# Altium project STM32F103RE.PrjPCB
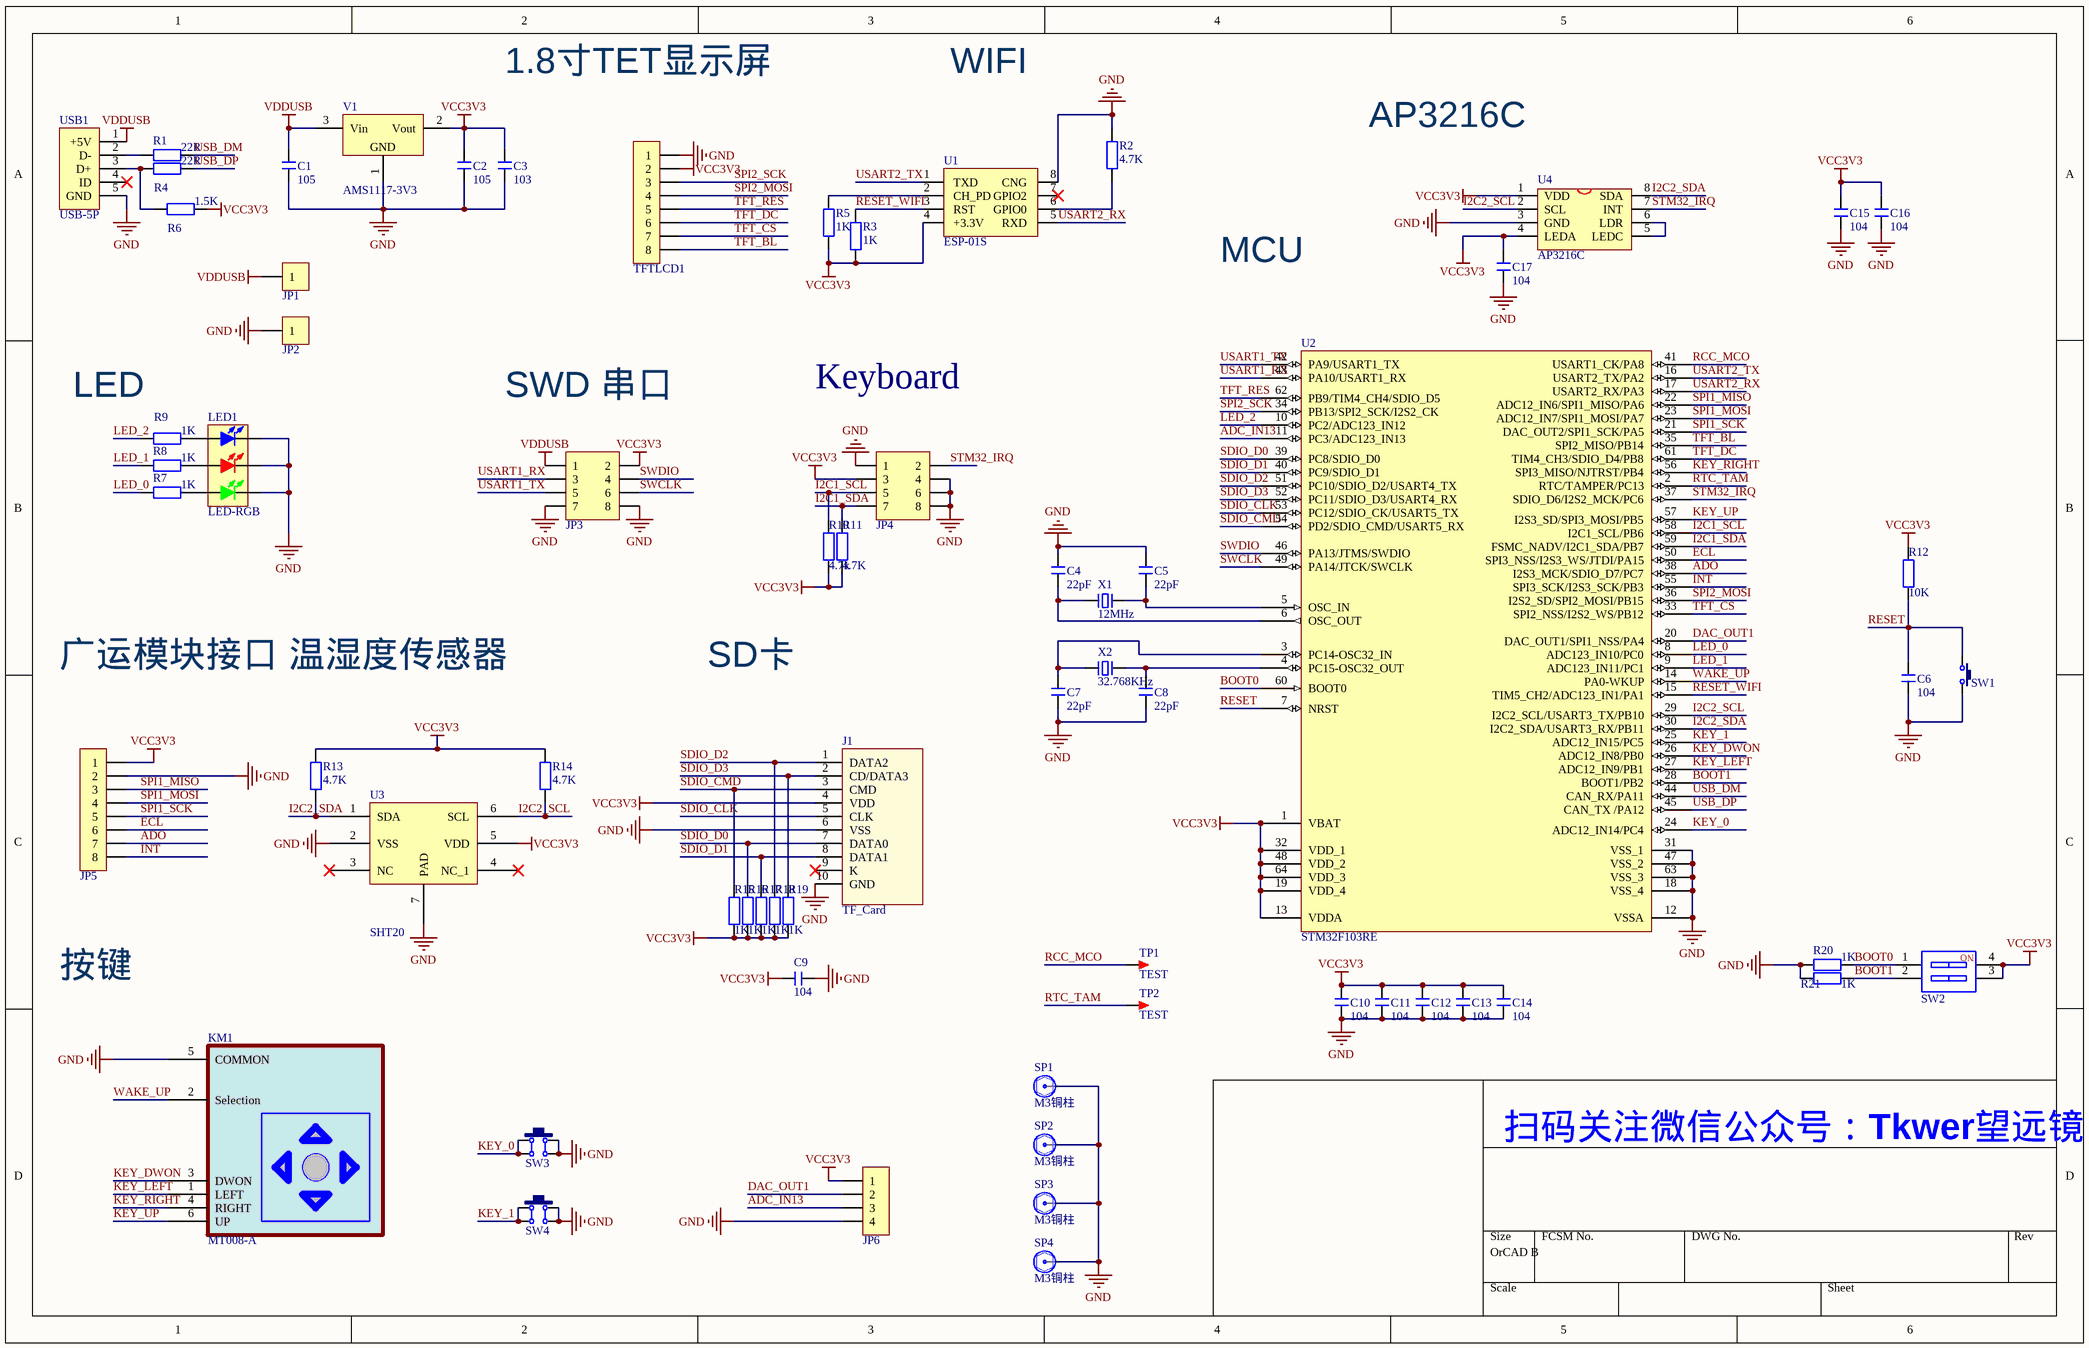
[diagram p0: STM32F103RE.SchDoc]
1 sheet, 66 parts. Net scope: global (net labels, ports and power ports of the same name join across sheets).
Board file: STM32F103RE.PcbDoc

## Sheet STM32F103RE.SchDoc
size OrCAD B

### Parts
C1  105  [C 0805_L]
C2  105  [C 0805_L]
C3  103  [C 0603_L]
C4  22pF  [C 0603_L]
C5  22pF  [C 0603_L]
C6  104  [C 0603_L]
C7  22pF  [C 0603_L]
C8  22pF  [C 0603_L]
C9  104  [C 0603_L]
C10  104  [C 0603_L]
C11  104  [C 0603_L]
C12  104  [C 0603_L]
C13  104  [C 0603_L]
C14  104  [C 0603_L]
C15  104  [C 0603_L]
C16  104  [C 0603_L]
C17  104  [C 0603_L]
J1  TF_Card  [Micro SD]
JP1  HDR-1X1  [HDR2.54-LI-1P]  (value not drawn)
JP2  HDR-1X1  [HDR2.54-LI-1P]  (value not drawn)
JP3  Header 4X2  [HDR2.54-WI-2x4P]  (value not drawn)
JP4  Header 4X2  [HDR2.54-WI-2x4P]  (value not drawn)
JP5  HDR-1X8  [HDR2.54-M-LI-8P]  (value not drawn)
JP6  HDR-1X4  [HDR2.54-LI-4P]  (value not drawn)
KM1  MT008-A  [JOY_MT008-A]
LED1  LED-RGB  [LED 5050]
R1  22R  [R 0603_L]
R2  4.7K  [R 0603_L]
R3  1K  [R 0603_L]
R4  22R  [R 0603_L]
R5  1K  [R 0603_L]
R6  1.5K  [R 0603_L]
R7  1K  [R 0603_L]
R8  1K  [R 0603_L]
R9  1K  [R 0603_L]
R10  4.7k  [R 0603_L]
R11  4.7K  [R 0603_L]
R12  10K  [R 0603_L]
R13  4.7K  [R 0603_L]
R14  4.7K  [R 0603_L]
R15  1K  [R 0603_L]
R16  1K  [R 0603_L]
R17  1K  [R 0603_L]
R18  1K  [R 0603_L]
R19  1K  [R 0603_L]
R20  1K  [R 0603_L]
R21  1K  [R 0603_L]
SP1  M3铜柱  [M3x4_L]
SP2  M3铜柱  [M3x4_L]
SP3  M3铜柱  [M3x4_L]
SP4  M3铜柱  [M3x4_L]
SW1  3x6x5  [TSW SMD-3*6*2.5]  (value not drawn)
SW2  CSW-2P  [CSW1.27 SMD-2P]  (value not drawn)
SW3  6x6x5  [SODFL700X110-2N]  (value not drawn)
SW4  6x6x5  [SODFL700X110-2N]  (value not drawn)
TFTLCD1  HDR-1X8  [HDR2.54-M-LI-8P]  (value not drawn)
TP1  TEST  [TEST 1.6]
TP2  TEST  [TEST 1.6]
U1  ESP-01S  [ESP-01S]
U2  STM32F103RE  [LQFP64 10X10_N]
U3  SHT20  [sht20]
U4  AP3216C  [DFN8]
USB1  USB-5P  [USB-MICRO_A]
V1  AMS1117-3V3  [SOT223_L]
X1  12MHz  [OSC 5032-2P]
X2  32.768KHz  [XTAL-3215]

### Nets
GND: C1.1 C2.1 C3.1 C4.2 C5.2 C6.1 C7.1 C8.1 C9.2 C10.1 C11.1 C12.1 C13.1 C14.1 C15.2 C16.2 C17.2 J1.6(VSS) J1.10(GND) JP2.1 JP3.7 JP3.8 JP4.1 JP4.4 JP4.6 JP4.8 JP5.2 JP6.4 KM1.5(COMMON) LED1.2(BULE_K) LED1.4(RED_K) LED1.6(GREEN_K) R2.2 R20.1 R21.1 SP1.1 SP2.1 SP3.1 SP4.1 SW1.2 SW3.2 SW3.3 SW4.2 SW4.3 TFTLCD1.1 U1.8(CNG) U2.12(VSSA) U2.18(VSS_4) U2.31(VSS_1) U2.47(VSS_2) U2.63(VSS_3) U3.2(VSS) U3.7(PAD) U4.3(GND) USB1.5(GND) V1.1(GND)
VCC3V3: C2.2 C3.2 C9.1 C10.2 C11.2 C12.2 C13.2 C14.2 C15.1 C16.1 C17.1 J1.4(VDD) JP3.2 JP4.3 JP5.1 JP6.1 R3.2 R5.2 R6.1 R10.1 R11.1 R12.2 R13.1 R14.1 R15.1 R16.1 R17.1 R18.1 R19.1 SW2.3 SW2.4 TFTLCD1.2 U1.4(+3.3V) U2.1(VBAT) U2.13(VDDA) U2.19(VDD_4) U2.32(VDD_1) U2.48(VDD_2) U2.64(VDD_3) U3.5(VDD) U4.1(VDD) U4.4(LEDA) V1.2(Vout)
VDDUSB: C1.2 JP1.1 JP3.1 USB1.1(+5V) V1.3(Vin)
ADC_IN13: JP6.3 U2.11(PC3/ADC123_IN13)
ADO: JP5.7 U2.38(I2S3_MCK/SDIO_D7/PC7)
BOOT0: R20.2 SW2.1 U2.60(BOOT0)
BOOT1: R21.2 SW2.2 U2.28(BOOT1/PB2)
DAC_OUT1: JP6.2 U2.20(DAC_OUT1/SPI1_NSS/PA4)
ECL: JP5.6 U2.50(SPI3_NSS/I2S3_WS/JTDI/PA15)
I2C1_SCL: JP4.5 R10.2 U2.58(I2C1_SCL/PB6)
I2C1_SDA: JP4.7 R11.2 U2.59(FSMC_NADV/I2C1_SDA/PB7)
I2C2_SCL: R14.2 U2.29(I2C2_SCL/USART3_TX/PB10) U3.6(SCL) U4.2(SCL)
I2C2_SDA: R13.2 U2.30(I2C2_SDA/USART3_RX/PB11) U3.1(SDA) U4.8(SDA)
INT: JP5.8 U2.55(SPI3_SCK/I2S3_SCK/PB3)
KEY_0: SW3.1 SW3.4 U2.24(ADC12_IN14/PC4)
KEY_1: SW4.1 SW4.4 U2.25(ADC12_IN15/PC5)
KEY_DWON: KM1.3(DWON) U2.26(ADC12_IN8/PB0)
KEY_LEFT: KM1.1(LEFT) U2.27(ADC12_IN9/PB1)
KEY_RIGHT: KM1.4(RIGHT) U2.56(SPI3_MISO/NJTRST/PB4)
KEY_UP: KM1.6(UP) U2.57(I2S3_SD/SPI3_MOSI/PB5)
LED_0: R7.2 U2.8(ADC123_IN10/PC0)
LED_1: R8.2 U2.9(ADC123_IN11/PC1)
LED_2: R9.2 U2.10(PC2/ADC123_IN12)
RCC_MCO: TP1.1 U2.41(USART1_CK/PA8)
RESET: C6.2 R12.1 SW1.1 U2.7(NRST)
RESET_WIFI: R3.1 U1.3(RST) U2.15(TIM5_CH2/ADC123_IN1/PA1)
RTC_TAM: TP2.1 U2.2(RTC/TAMPER/PC13)
SDIO_CLK: J1.5(CLK) U2.53(PC12/SDIO_CK/USART5_TX)
SDIO_CMD: J1.3(CMD) R15.2 U2.54(PD2/SDIO_CMD/USART5_RX)
SDIO_D0: J1.7(DATA0) R16.2 U2.39(PC8/SDIO_D0)
SDIO_D1: J1.8(DATA1) R17.2 U2.40(PC9/SDIO_D1)
SDIO_D2: J1.1(DATA2) R18.2 U2.51(PC10/SDIO_D2/USART4_TX)
SDIO_D3: J1.2(CD/DATA3) R19.2 U2.52(PC11/SDIO_D3/USART4_RX)
SPI1_MISO: JP5.3 U2.22(ADC12_IN6/SPI1_MISO/PA6)
SPI1_MOSI: JP5.4 U2.23(ADC12_IN7/SPI1_MOSI/PA7)
SPI1_SCK: JP5.5 U2.21(DAC_OUT2/SPI1_SCK/PA5)
SPI2_MOSI: TFTLCD1.4 U2.36(I2S2_SD/SPI2_MOSI/PB15)
SPI2_SCK: TFTLCD1.3 U2.34(PB13/SPI2_SCK/I2S2_CK)
STM32_IRQ: JP4.2 U2.37(SDIO_D6/I2S2_MCK/PC6) U4.7(INT)
SWCLK: JP3.6 U2.49(PA14/JTCK/SWCLK)
SWDIO: JP3.4 U2.46(PA13/JTMS/SWDIO)
TFT_BL: TFTLCD1.8 U2.35(SPI2_MISO/PB14)
TFT_CS: TFTLCD1.7 U2.33(SPI2_NSS/I2S2_WS/PB12)
TFT_DC: TFTLCD1.6 U2.61(TIM4_CH3/SDIO_D4/PB8)
TFT_RES: TFTLCD1.5 U2.62(PB9/TIM4_CH4/SDIO_D5)
USART1_RX: JP3.3 U2.43(PA10/USART1_RX)
USART1_TX: JP3.5 U2.42(PA9/USART1_TX)
USART2_RX: U1.5(RXD) U2.17(USART2_RX/PA3)
USART2_TX: U1.1(TXD) U2.16(USART2_TX/PA2)
USB_DM: R1.1 U2.44(CAN_RX/PA11)
USB_DP: R4.1 U2.45(CAN_TX_/PA12)
WAKE_UP: KM1.2(Selection) U2.14(PA0-WKUP)
NetC4_1: C4.1 U2.6(OSC_OUT) X1.2
NetC5_1: C5.1 U2.5(OSC_IN) X1.1
NetC7_2: C7.2 U2.3(PC14-OSC32_IN) X2.2
NetC8_2: C8.2 U2.4(PC15-OSC32_OUT) X2.1
NetLED1_1: LED1.1(BULE_A) R9.1
NetLED1_3: LED1.3(RED_A) R8.1
NetLED1_5: LED1.5(GREEN_A) R7.1
NetR1_2: R1.2 USB1.2(D-)
NetR2_1: R2.1 U1.6(GPIO0)
NetR4_2: R4.2 R6.2 USB1.3(D+)
NetR5_1: R5.1 U1.2(CH_PD)
NetU4_5: U4.5(LEDC) U4.6(LDR)

Not connected (* = marked no-connect by the designer): J1 9(K)*; U1 7(GPIO2)*; U3 3(NC)* 4(NC_1)*; USB1 4(ID)*

### Notes on the sheet
- 1.8寸TET显示屏
- WIFI
- AP3216C
- MCU
- LED
- SWD 串口
- Keyboard
- 广运模块接口
- 温湿度传感器
- SD卡
- 按键
- 扫码关注微信公众号：Tkwer望远镜
- (in symbol CSW-2P) NO

### Library data of the parts
C1-C17 = C: 无极性贴片电容; 版权归属: 源创客; BOM名称: 无极性贴片电容; 学习资源: www.ooocke.com
J1 = TF_Card: TF卡座; 版权归属: 源创客; BOM名称: TF卡座; 学习资源: www.ooocke.com
JP1 JP2 = Header 1: 1P接插件; 版权归属: 源创客; BOM名称: 1P接插件; 学习资源: www.ooocke.com
JP3 JP4 = Header 4X2: 4*2P接插件; 版权归属: 源创客; BOM名称: 4*2P接插件; 学习资源: www.ooocke.com
JP5 TFTLCD1 = Header 8: 8P接插件; 版权归属: 源创客; BOM名称: 8P接插件; 学习资源: www.ooocke.com
JP6 = Header 4: 4P接插件; 版权归属: 源创客; BOM名称: 4P接插件; 学习资源: www.ooocke.com
KM1 = MT-008A
LED1 = LED-RGB: 三基色LED; 版权归属: 源创客; BOM名称: 三基色LED; 学习资源: www.ooocke.com
R1-R21 = R: 贴片电阻; 版权归属: 源创客; BOM名称: 贴片电阻; 学习资源: www.ooocke.com
SP1-SP4 = 铜柱小焊盘: 铜柱; 版权归属: 源创客; BOM名称: 铜柱; 学习资源: www.ooocke.com
SW1 = TSW 3x6: 3x6轻触开关; 版权归属: 源创客; BOM名称: 3x6轻触开关; 学习资源: www.ooocke.com
SW2 = CSW-2P: 2路编码开关; 版权归属: 源创客; BOM名称: 2路编码开关; 学习资源: www.ooocke.com
SW3 SW4 = TSW SMD-6x6: 贴片6x6轻触开关; 版权归属: 源创客; BOM名称: 贴片6x6轻触开关; 学习资源: www.ooocke.com
TP1 TP2 = TEST: 测试点; 版权归属: 源创客; BOM名称: 测试点; 学习资源: www.ooocke.com
U2 = STM32F103RE: 32位STM单片机; 版权归属: 源创客; BOM名称: 32位STM单片机; 学习资源: www.ooocke.com
U4 = AP3216C: ALS+PS Sensor
USB1 = USB-5P: 微型USB母座; 版权归属: 源创客; BOM名称: 微型USB母座; 学习资源: www.ooocke.com
V1 = AMS1117: 三端稳压芯片; BOM名称: 稳压芯片; 版权归属: 源创客; 学习资源: www.ooocke.com
X1 X2 = XTAL-2: 2脚晶振; 版权归属: 源创客; BOM名称: 2脚晶振; 学习资源: www.ooocke.com